# Altium schematic sheet MaximAnalogSignalInterface.SchDoc
size A
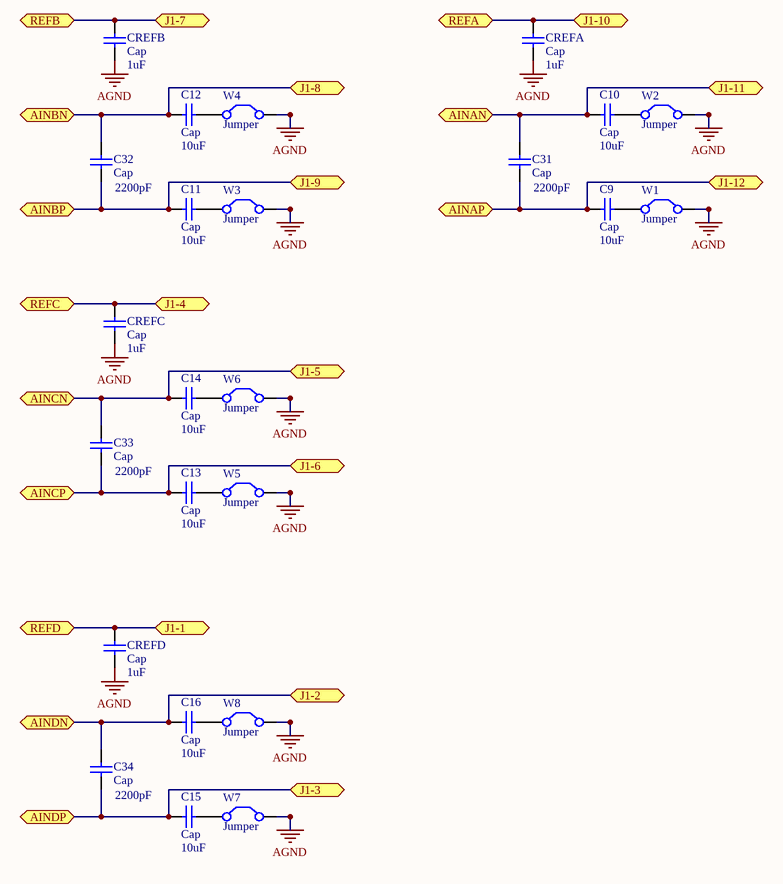
[diagram p0: MaximAnalogSignalInterface.SchDoc]

## Parts
C9  Cap  value 10uF  [RAD-0.3]
C10  Cap  value 10uF  [RAD-0.3]
C11  Cap  value 10uF  [RAD-0.3]
C12  Cap  value 10uF  [RAD-0.3]
C13  Cap  value 10uF  [RAD-0.3]
C14  Cap  value 10uF  [RAD-0.3]
C15  Cap  value 10uF  [RAD-0.3]
C16  Cap  value 10uF  [RAD-0.3]
C31  Cap  value 2200pF  [RAD-0.3]
C32  Cap  value 2200pF  [RAD-0.3]
C33  Cap  value 2200pF  [RAD-0.3]
C34  Cap  value 2200pF  [RAD-0.3]
CREFA  Cap  value 1uF  [RAD-0.3]
CREFB  Cap  value 1uF  [RAD-0.3]
CREFC  Cap  value 1uF  [RAD-0.3]
CREFD  Cap  value 1uF  [RAD-0.3]
W1  Jumper  [RAD-0.2]
W2  Jumper  [RAD-0.2]
W3  Jumper  [RAD-0.2]
W4  Jumper  [RAD-0.2]
W5  Jumper  [RAD-0.2]
W6  Jumper  [RAD-0.2]
W7  Jumper  [RAD-0.2]
W8  Jumper  [RAD-0.2]

## Ports
AINAN, AINAP, AINBN, AINBP, AINCN, AINCP, AINDN, AINDP, J1-1, J1-2, J1-3, J1-4, J1-5, J1-6, J1-7, J1-8, J1-9, J1-10, J1-11, J1-12, REFA, REFB, REFC, REFD

## Nets
AGND: CREFA.1 CREFB.1 CREFC.1 CREFD.1 W1.2(C2) W2.2(C2) W3.2(C2) W4.2(C2) W5.2(C2) W6.2(C2) W7.2(C2) W8.2(C2)
AINAN: C10.2 C31.2 ; port J1-11, port AINAN
AINAP: C9.2 C31.1 ; port J1-12, port AINAP
AINBN: C12.2 C32.2 ; port J1-8, port AINBN
AINBP: C11.2 C32.1 ; port J1-9, port AINBP
AINCN: C14.2 C33.2 ; port J1-5, port AINCN
AINCP: C13.2 C33.1 ; port J1-6, port AINCP
AINDN: C16.2 C34.2 ; port J1-2, port AINDN
AINDP: C15.2 C34.1 ; port J1-3, port AINDP
J1-1: CREFD.2 ; port J1-1, port REFD
J1-4: CREFC.2 ; port J1-4, port REFC
J1-7: CREFB.2 ; port J1-7, port REFB
J1-10: CREFA.2 ; port J1-10, port REFA
NetC9_1: C9.1 W1.1(C1)
NetC10_1: C10.1 W2.1(C1)
NetC11_1: C11.1 W3.1(C1)
NetC12_1: C12.1 W4.1(C1)
NetC13_1: C13.1 W5.1(C1)
NetC14_1: C14.1 W6.1(C1)
NetC15_1: C15.1 W7.1(C1)
NetC16_1: C16.1 W8.1(C1)

## Library data of the parts
C9-C16 C31-C34 CREFA CREFB CREFC CREFD = Cap: Capacitor; Published: 8-Jun-2000; LatestRevisionDate: 17-Jul-2002; LatestRevisionNote: Re-released for DXP Platform.; PackageReference: RAD-0.3; Publisher: Altium Limited; PackageDescription: Radial Cap, Thru-Hole; 2 Leads; 0.3 in Pin Spacing
W1-W8 = Jumper: Jumper Wire; Published: 24-Mar-1999; LatestRevisionDate: 17-Jul-2002; LatestRevisionNote: Re-released for DXP Platform.; PackageReference: RAD-0.2; Publisher: Altium Limited; PackageDescription: Radial Cap, Thru-Hole; 2 Leads; 0.2 in Pin Spacing